# Altium schematic sheet 连接.SchDoc
size A
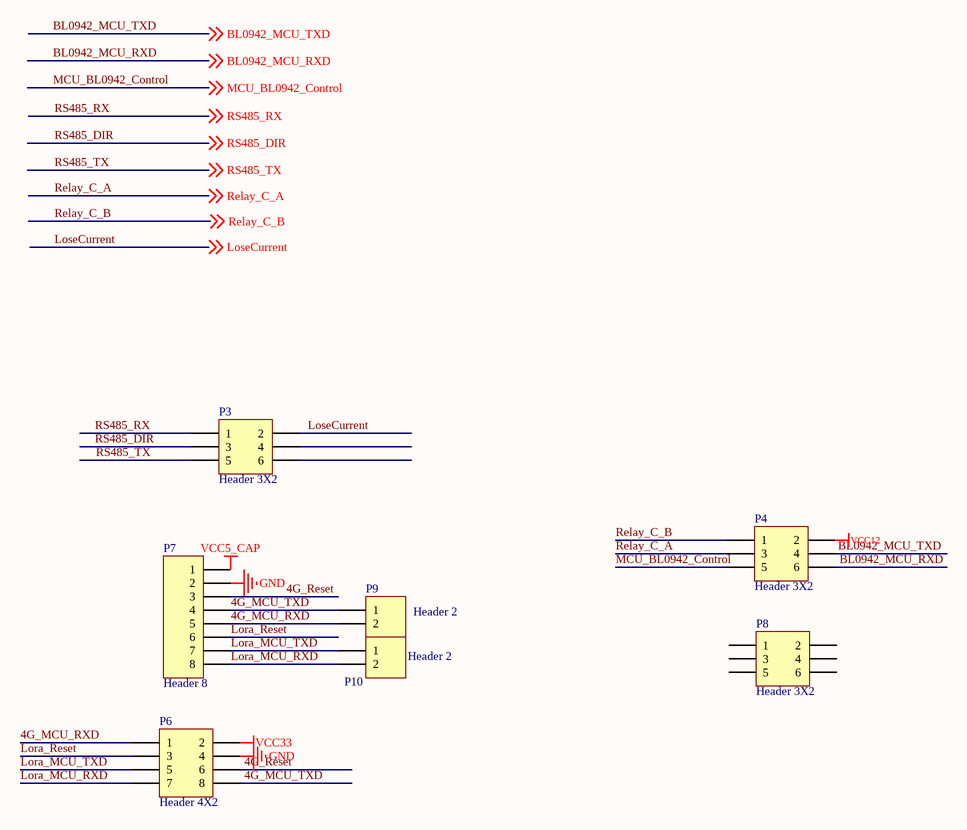
[diagram p0: 连接.SchDoc]

## Parts
P3  Header 3X2  [CONN-SMD_5BME8-08872-203-W0]
P4  Header 3X2  [CONN-SMD_5BME8-08872-203-W0]
P6  Header 4X2  [CONN-SMD_5BME8-08872-204-W0]
P7  Header 8  [HDR1X8]
P8  Header 3X2  [CONN-SMD_5BME8-08872-203-W0]
P9  Header 2  [HDR1X2]
P10  Header 2  [HDR1X2]

## Nets
GND: P6.4 P7.2
VCC5_CAP: P7.1
VCC12: P4.2
VCC33: P6.2
4G_MCU_RXD: P6.1 P7.5 P9.2
4G_MCU_TXD: P6.8 P7.4 P9.1
4G_Reset: P6.6 P7.3
BL0942_MCU_RXD: P4.6 ; off-sheet BL0942_MCU_RXD
BL0942_MCU_TXD: P4.4 ; off-sheet BL0942_MCU_TXD
Lora_MCU_RXD: P6.7 P7.8 P10.2
Lora_MCU_TXD: P6.5 P7.7 P10.1
Lora_Reset: P6.3 P7.6
LoseCurrent: P3.2 ; off-sheet LoseCurrent
MCU_BL0942_Control: P4.5 ; off-sheet MCU_BL0942_Control
Relay_C_A: P4.3 ; off-sheet Relay_C_A
Relay_C_B: P4.1 ; off-sheet Relay_C_B
RS485_DIR: P3.3 ; off-sheet RS485_DIR
RS485_RX: P3.1 ; off-sheet RS485_RX
RS485_TX: P3.5 ; off-sheet RS485_TX

Not connected (* = marked no-connect by the designer): P3 4 6; P8 1 2 3 4 5 6

## Library data of the parts
P3 P4 P8 = Header 3X2: Header, 3-Pin, Dual row; LatestRevisionDate: 17-Jul-2002; LatestRevisionNote: Re-released for DXP Platform.; Publisher: Altium Limited
P6 = Header 4X2: Header, 4-Pin, Dual row; LatestRevisionDate: 17-Jul-2002; LatestRevisionNote: Re-released for DXP Platform.; Publisher: Altium Limited
P7 = Header 8: Header, 8-Pin; LatestRevisionDate: 17-Jul-2002; LatestRevisionNote: Re-released for DXP Platform.; Publisher: Altium Limited
P9 P10 = Header 2: Header, 2-Pin; LatestRevisionDate: 17-Jul-2002; LatestRevisionNote: Re-released for DXP Platform.; Publisher: Altium Limited